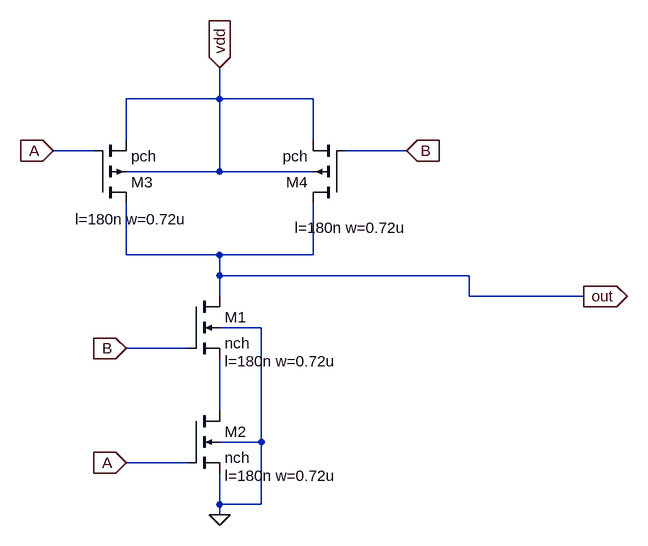
[diagram p0: schematic NAND_2.asc]
NAND_2.asc, the LTspice schematic file:
Version 4
SHEET 1 1640 724
WIRE 544 64 544 16
WIRE 544 64 400 64
WIRE 688 64 544 64
WIRE 400 128 400 64
WIRE 688 128 688 64
WIRE 352 144 288 144
WIRE 832 144 736 144
WIRE 544 176 544 64
WIRE 544 176 400 176
WIRE 688 176 544 176
WIRE 400 304 400 224
WIRE 544 304 400 304
WIRE 688 304 688 224
WIRE 688 304 544 304
WIRE 544 336 544 304
WIRE 928 336 544 336
WIRE 544 368 544 336
WIRE 928 368 928 336
WIRE 1104 368 928 368
WIRE 608 416 544 416
WIRE 496 448 400 448
WIRE 544 544 544 464
WIRE 608 592 608 416
WIRE 608 592 544 592
WIRE 496 624 400 624
WIRE 544 688 544 640
WIRE 608 688 608 592
WIRE 608 688 544 688
WIRE 544 704 544 688
FLAG 1104 368 out
IOPIN 1104 368 Out
FLAG 544 704 0
FLAG 544 16 vdd
IOPIN 544 16 In
FLAG 288 144 A
IOPIN 288 144 In
FLAG 400 624 A
IOPIN 400 624 In
FLAG 400 448 B
IOPIN 400 448 In
FLAG 832 144 B
IOPIN 832 144 In
SYMBOL nmos4 496 544 R0
WINDOW 123 56 100 Left 2
SYMATTR Value2 l=180n w=0.72u
SYMATTR InstName M2
SYMATTR Value nch
SYMBOL nmos4 496 368 R0
WINDOW 123 56 100 Left 2
SYMATTR Value2 l=180n w=0.72u
SYMATTR InstName M1
SYMATTR Value nch
SYMBOL pmos4 352 224 M180
WINDOW 123 -30 -25 Left 2
SYMATTR Value2 l=180n w=0.72u
SYMATTR InstName M3
SYMATTR Value pch
SYMBOL pmos4 736 224 R180
WINDOW 123 -96 -38 Left 2
SYMATTR Value2 l=180n w=0.72u
SYMATTR InstName M4
SYMATTR Value pch

The netlist it stands for:
* NAND_2.asc
M2 N001 A 0 0 nch l=180n w=0.72u
M1 out B N001 0 nch l=180n w=0.72u
M3 out A vdd vdd pch l=180n w=0.72u
M4 out B vdd vdd pch l=180n w=0.72u
.model NMOS NMOS
.model PMOS PMOS
.lib standard.mos
.backanno
.end